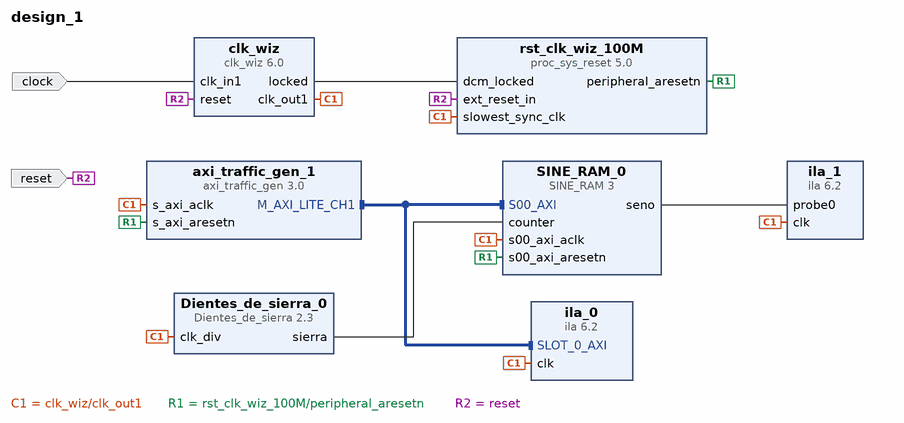
[diagram p0: block diagram of the top level]
# Vivado block design design_1, xc7z010clg400-1, Vivado 2020.1
create_bd_design design_1

create_bd_port -dir I -type clk clock
set_property -dict {CONFIG.FREQ_HZ 125000000 CONFIG.PHASE 0.000} [get_bd_ports clock]
create_bd_port -dir I -type rst reset
set_property -dict {CONFIG.POLARITY ACTIVE_HIGH} [get_bd_ports reset]

create_bd_cell -type ip -vlnv xilinx.com:ip:axi_traffic_gen:3.0 axi_traffic_gen_1
set_property -dict [list \
  CONFIG.C_ATG_MIF_DATA_DEPTH 256 \
  CONFIG.C_ATG_MODE AXI4-Lite \
  CONFIG.C_ATG_SYSINIT_MODES System_Test \
  CONFIG.C_ATG_SYSTEM_CMD_MAX_RETRY 2147483647 \
  CONFIG.C_ATG_SYSTEM_INIT_ADDR_MIF {../../../../../../../Extras/coe lite/addr_sin.coe} \
  CONFIG.C_ATG_SYSTEM_INIT_CTRL_MIF {../../../../../../../Extras/coe lite/ctrl_sin.coe} \
  CONFIG.C_ATG_SYSTEM_INIT_DATA_MIF {../../../../../../../Extras/coe lite/data_sin.coe} \
  CONFIG.C_ATG_SYSTEM_INIT_MASK_MIF {../../../../../../../Extras/coe lite/mask_sin.coe} \
] [get_bd_cells axi_traffic_gen_1]
create_bd_cell -type ip -vlnv xilinx.com:ip:ila:6.2 ila_0
set_property -dict [list \
  CONFIG.ALL_PROBE_SAME_MU_CNT 2 \
  CONFIG.C_ADV_TRIGGER false \
  CONFIG.C_ENABLE_ILA_AXI_MON true \
  CONFIG.C_EN_STRG_QUAL 0 \
  CONFIG.C_MONITOR_TYPE AXI \
  CONFIG.C_NUM_OF_PROBES 19 \
  CONFIG.C_PROBE0_MU_CNT 2 \
  CONFIG.C_PROBE0_WIDTH 1 \
  CONFIG.C_PROBE10_MU_CNT 2 \
  CONFIG.C_PROBE11_MU_CNT 2 \
  CONFIG.C_PROBE12_MU_CNT 2 \
  CONFIG.C_PROBE13_MU_CNT 2 \
  CONFIG.C_PROBE14_MU_CNT 2 \
  CONFIG.C_PROBE15_MU_CNT 2 \
  CONFIG.C_PROBE16_MU_CNT 2 \
  CONFIG.C_PROBE17_MU_CNT 2 \
  CONFIG.C_PROBE18_MU_CNT 2 \
  CONFIG.C_PROBE19_MU_CNT 2 \
  CONFIG.C_PROBE1_MU_CNT 2 \
  CONFIG.C_PROBE1_WIDTH 1 \
  CONFIG.C_PROBE20_MU_CNT 2 \
  CONFIG.C_PROBE21_MU_CNT 2 \
  CONFIG.C_PROBE22_MU_CNT 2 \
  CONFIG.C_PROBE23_MU_CNT 2 \
  CONFIG.C_PROBE24_MU_CNT 2 \
  CONFIG.C_PROBE25_MU_CNT 2 \
  CONFIG.C_PROBE26_MU_CNT 2 \
  CONFIG.C_PROBE27_MU_CNT 2 \
  CONFIG.C_PROBE28_MU_CNT 2 \
  CONFIG.C_PROBE29_MU_CNT 2 \
  CONFIG.C_PROBE2_MU_CNT 2 \
  CONFIG.C_PROBE30_MU_CNT 2 \
  CONFIG.C_PROBE31_MU_CNT 2 \
  CONFIG.C_PROBE32_MU_CNT 2 \
  CONFIG.C_PROBE33_MU_CNT 2 \
  CONFIG.C_PROBE34_MU_CNT 2 \
  CONFIG.C_PROBE35_MU_CNT 2 \
  CONFIG.C_PROBE36_MU_CNT 2 \
  CONFIG.C_PROBE37_MU_CNT 2 \
  CONFIG.C_PROBE38_MU_CNT 2 \
  CONFIG.C_PROBE39_MU_CNT 2 \
  CONFIG.C_PROBE3_MU_CNT 2 \
  CONFIG.C_PROBE40_MU_CNT 2 \
  CONFIG.C_PROBE41_MU_CNT 2 \
  CONFIG.C_PROBE42_MU_CNT 2 \
  CONFIG.C_PROBE43_MU_CNT 2 \
  CONFIG.C_PROBE4_MU_CNT 2 \
  CONFIG.C_PROBE5_MU_CNT 2 \
  CONFIG.C_PROBE6_MU_CNT 2 \
  CONFIG.C_PROBE7_MU_CNT 2 \
  CONFIG.C_PROBE8_MU_CNT 2 \
  CONFIG.C_PROBE9_MU_CNT 2 \
] [get_bd_cells ila_0]
create_bd_cell -type ip -vlnv xilinx.com:ip:clk_wiz:6.0 clk_wiz
set_property -dict {CONFIG.CLK_IN1_BOARD_INTERFACE sys_clock CONFIG.USE_BOARD_FLOW true} [get_bd_cells clk_wiz]
create_bd_cell -type ip -vlnv xilinx.com:ip:proc_sys_reset:5.0 rst_clk_wiz_100M
create_bd_cell -type ip -vlnv xilinx.com:user:Dientes_de_sierra:2.3 Dientes_de_sierra_0
create_bd_cell -type ip -vlnv xilinx.com:user:SINE_RAM:3 SINE_RAM_0
create_bd_cell -type ip -vlnv xilinx.com:ip:ila:6.2 ila_1
set_property -dict [list \
  CONFIG.C_ENABLE_ILA_AXI_MON false \
  CONFIG.C_MONITOR_TYPE Native \
  CONFIG.C_NUM_OF_PROBES 1 \
  CONFIG.C_PROBE0_WIDTH 8 \
] [get_bd_cells ila_1]

# ---- connections ----

connect_bd_intf_net [get_bd_intf_pins axi_traffic_gen_1/M_AXI_LITE_CH1] [get_bd_intf_pins SINE_RAM_0/S00_AXI]
connect_bd_intf_net [get_bd_intf_pins axi_traffic_gen_1/M_AXI_LITE_CH1] [get_bd_intf_pins ila_0/SLOT_0_AXI]
connect_bd_net [get_bd_pins clk_wiz/clk_out1] \
  [get_bd_pins ila_0/clk] [get_bd_pins axi_traffic_gen_1/s_axi_aclk] [get_bd_pins rst_clk_wiz_100M/slowest_sync_clk] \
  [get_bd_pins Dientes_de_sierra_0/clk_div] [get_bd_pins SINE_RAM_0/s00_axi_aclk] [get_bd_pins ila_1/clk]
connect_bd_net [get_bd_pins clk_wiz/locked] [get_bd_pins rst_clk_wiz_100M/dcm_locked]
connect_bd_net [get_bd_pins rst_clk_wiz_100M/peripheral_aresetn] \
  [get_bd_pins axi_traffic_gen_1/s_axi_aresetn] [get_bd_pins SINE_RAM_0/s00_axi_aresetn]
connect_bd_net -net sys_clock_1 [get_bd_ports clock] [get_bd_pins clk_wiz/clk_in1]
connect_bd_net -net reset_rtl_1 [get_bd_ports reset] [get_bd_pins clk_wiz/reset] [get_bd_pins rst_clk_wiz_100M/ext_reset_in]
connect_bd_net [get_bd_pins Dientes_de_sierra_0/sierra] [get_bd_pins SINE_RAM_0/counter]
connect_bd_net [get_bd_pins SINE_RAM_0/seno] [get_bd_pins ila_1/probe0]

# ---- address map ----
assign_bd_address -offset 0x44A00000 -range 64K -target_address_space [get_bd_addr_spaces axi_traffic_gen_1/Reg1] [get_bd_addr_segs SINE_RAM_0/S00_AXI/S00_AXI_reg]

validate_bd_design
save_bd_design
